# Altium project PuenteHay.PrjPcb
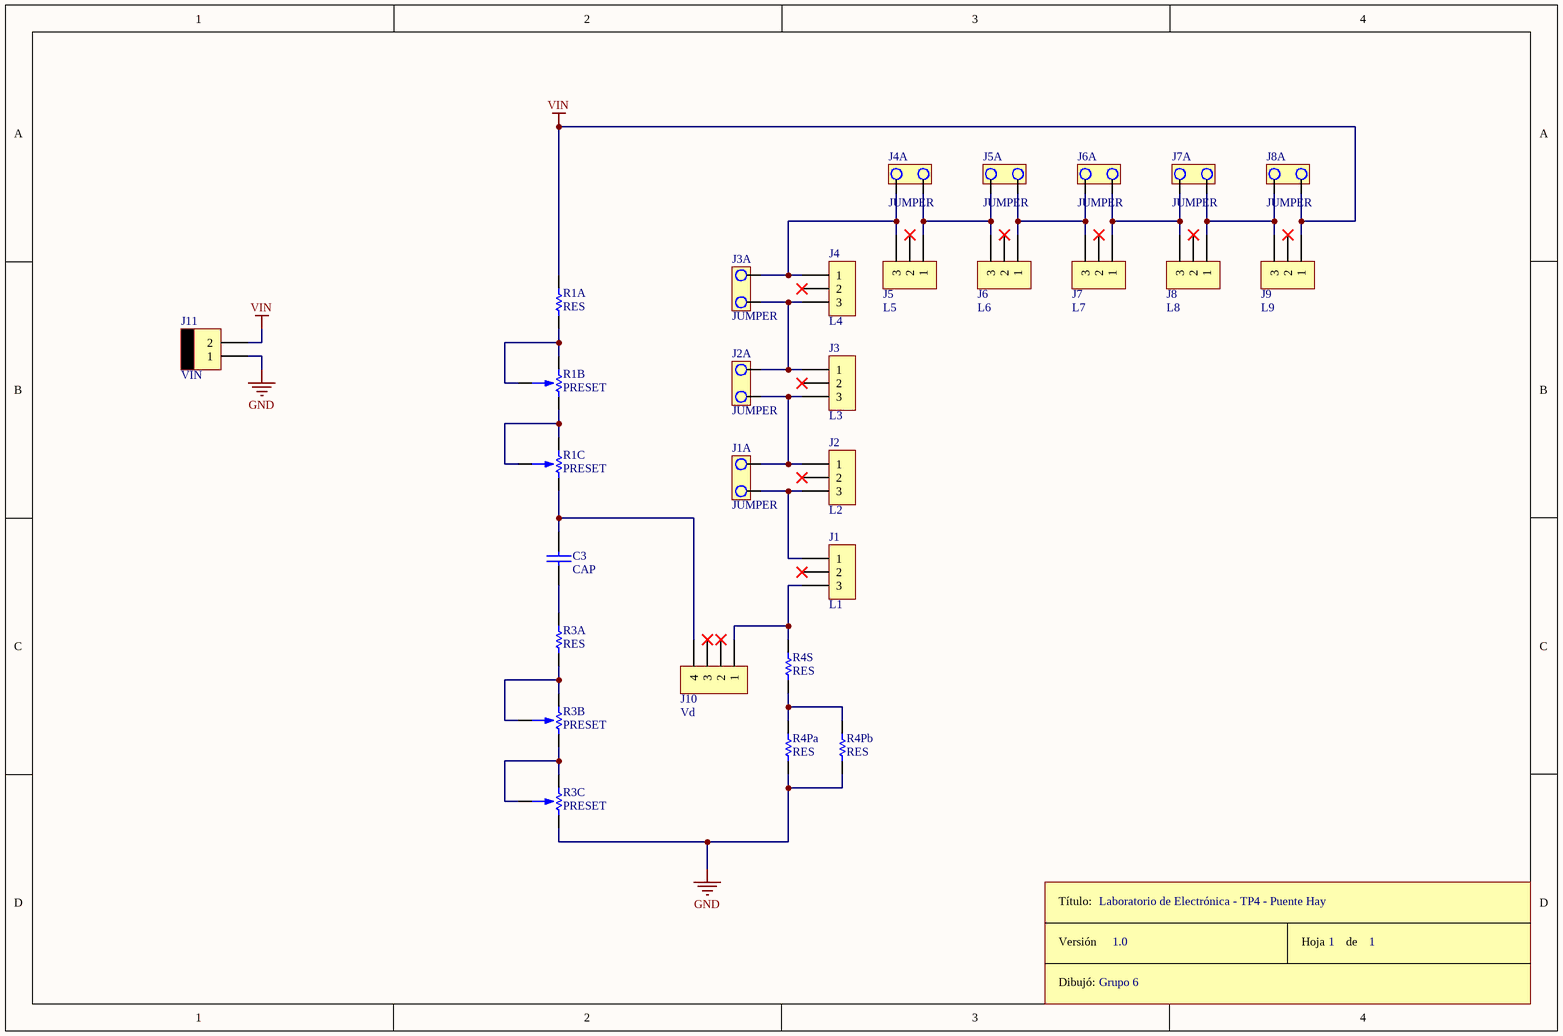
[diagram p0: PuenteHayEsquematico.SchDoc]
1 sheet, 30 parts. Net scope: global (net labels, ports and power ports of the same name join across sheets).
Board file: PuenteHay_Placa.PcbDoc

## Sheet PuenteHayEsquematico.SchDoc
size A4

### Parts
C3  CAP  [CAP200]
J1  L1  [SIP3]
J1A  JUMPER  [JUMPER2]
J2  L2  [SIP3]
J2A  JUMPER  [JUMPER2]
J3  L3  [SIP3]
J3A  JUMPER  [JUMPER2]
J4  L4  [SIP3]
J4A  JUMPER  [JUMPER2]
J5  L5  [SIP3]
J5A  JUMPER  [JUMPER2]
J6  L6  [SIP3]
J6A  JUMPER  [JUMPER2]
J7  L7  [SIP3]
J7A  JUMPER  [JUMPER2]
J8  L8  [SIP3]
J8A  JUMPER  [JUMPER2]
J9  L9  [SIP3]
J10  Vd  [SIP4]
J11  VIN  [MOLEX2]
R1A  RES  [RES300]
R1B  PRESET  [PRESET V]
R1C  PRESET  [PRESET V]
R3A  RES  [RES300]
R3B  PRESET  [PRESET V]
R3C  PRESET  [PRESET V]
R4Pa  RES  [RES300]
R4Pb  RES  [RES300]
R4S  RES  [RES300]
ROT1  Rótulo  (value not drawn)

### Nets
GND: J11.1 R3C.1 R4Pa.1 R4Pb.1
VIN: J8A.1 J9.1 J11.2 R1A.2
NetC3_1: C3.1 J10.4 R1C.1
NetC3_2: C3.2 R3A.2
NetJ1_1: J1.1 J1A.2 J2.3
NetJ1_3: J1.3 J10.1 R4S.2
NetJ1A_1: J1A.1 J2.1 J2A.2 J3.3
NetJ2A_1: J2A.1 J3.1 J3A.2 J4.3
NetJ3A_1: J3A.1 J4.1 J4A.2 J5.3
NetJ4A_1: J4A.1 J5.1 J5A.2 J6.3
NetJ5A_1: J5A.1 J6.1 J6A.2 J7.3
NetJ6A_1: J6A.1 J7.1 J7A.2 J8.3
NetJ7A_1: J7A.1 J8.1 J8A.2 J9.3
NetR1A_1: R1A.1 R1B.2 R1B.3
NetR1B_1: R1B.1 R1C.2 R1C.3
NetR3A_1: R3A.1 R3B.2 R3B.3
NetR3B_1: R3B.1 R3C.2 R3C.3
NetR4Pa_2: R4Pa.2 R4Pb.2 R4S.1

Not connected (* = marked no-connect by the designer): J1 2*; J2 2*; J3 2*; J4 2*; J5 2*; J6 2*; J7 2*; J8 2*; J9 2*; J10 2* 3*

### Notes on the sheet
- Laboratorio de Electrónica - TP4 - Puente Hay
- Grupo 6
- 1.0
- 1
- (in symbol Rótulo) Título:; Versión; Hoja       de; Dibujó:

### Library data of the parts
J1-J9 = CON3
J10 = CON4
J11 = MOLEX2